# Altium schematic sheet 00_Main.SchDoc
size A; SheetNumber: 1; SheetTotal: 7
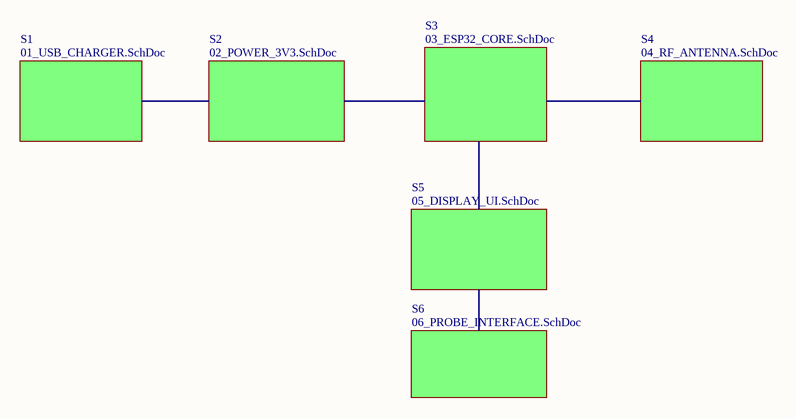
[diagram p0: 00_Main.SchDoc]

## Sub-sheets
S1 = 01_USB_CHARGER.SchDoc: no entries
S2 = 02_POWER_3V3.SchDoc: no entries
S3 = 03_ESP32_CORE.SchDoc: no entries
S4 = 04_RF_ANTENNA.SchDoc: no entries
S5 = 05_DISPLAY_UI.SchDoc: no entries
S6 = 06_PROBE_INTERFACE.SchDoc: no entries